# Altium project PCB_Project_3.PrjPcb
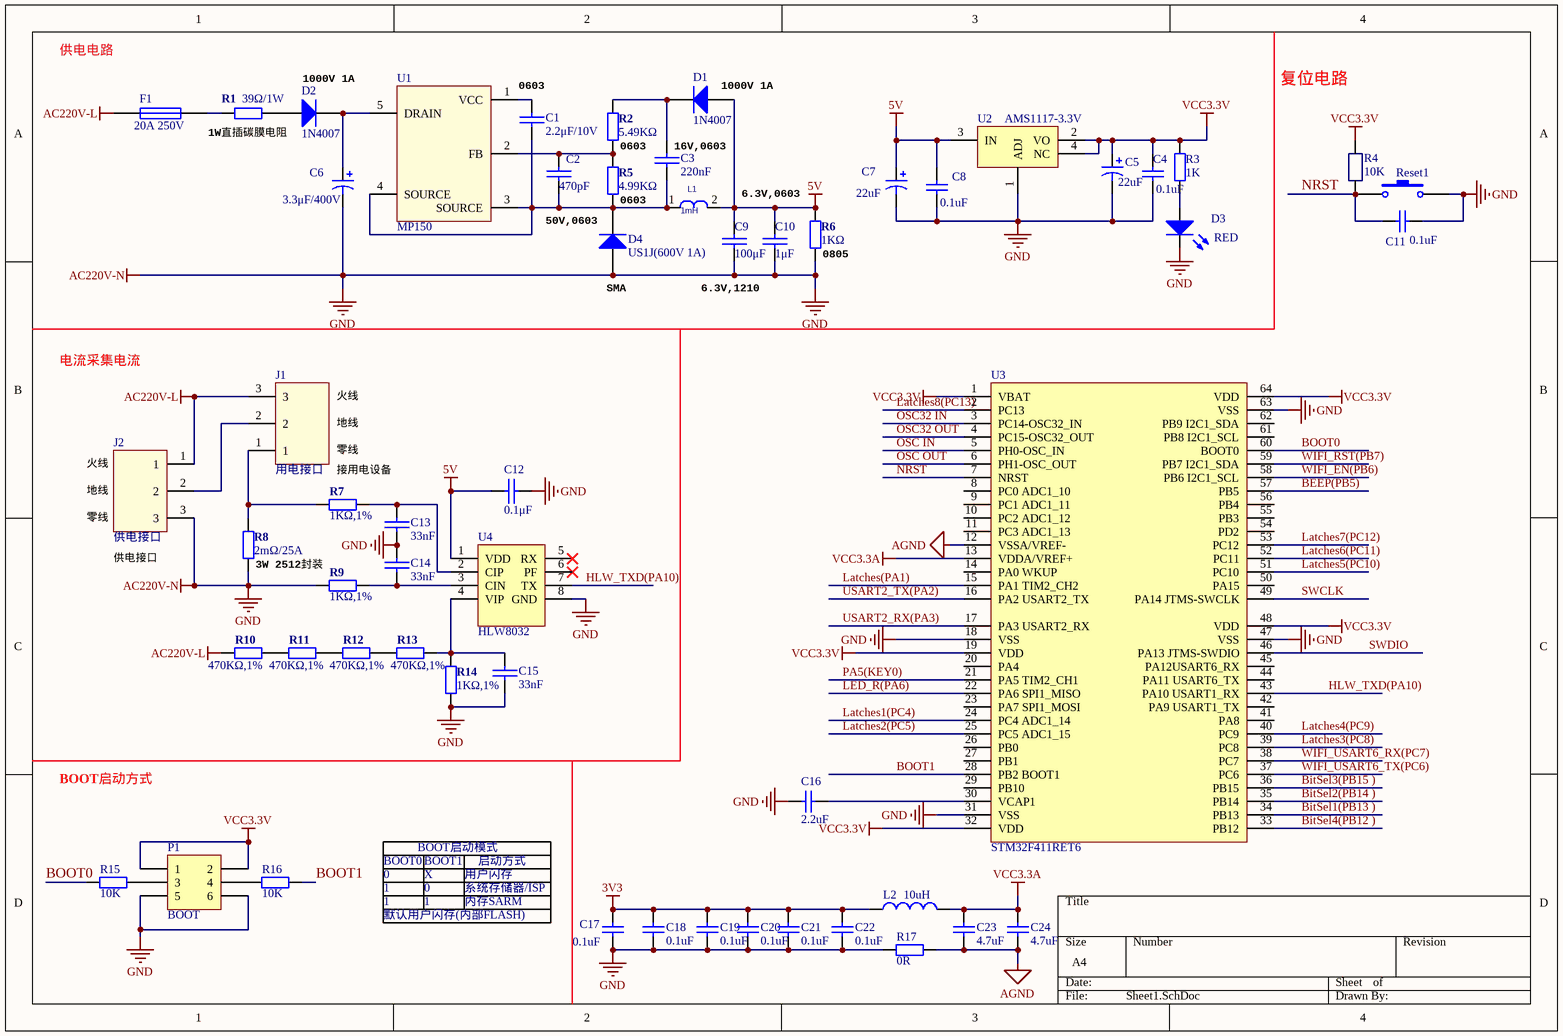
[diagram p0: Sheet1.SchDoc]
2 sheets, 99 parts. Net scope: global (net labels, ports and power ports of the same name join across sheets).
Board file: PCB1.PcbDoc
Sheets:
  Sheet1.SchDoc
  Sheet2.SchDoc

## Sheet Sheet1.SchDoc
size A4

### Parts
C1  2.2μF/10V  [LC-0603_C(2.2UF/10V)]
C2  470pF  [LC-0603_C(普通电容)]
C3  220nF  [LC-0603_C(普通电容)]
C4  0.1uF  [LC-0603_C(普通电容)]
C5  22uF  [钽电容0603（25v）]
C6  3.3μF/400V  [直插电解电容 - duplicate]
C7  22uF  [钽电容0603（25v）]
C8  0.1uF  [LC-0603_C(普通电容)]
C9  100μF  [LC-1210_C大电容]
C10  1μF  [LC-0603_C(普通电容)]
C11  0.1uF  [LC-0603_C(普通电容)]
C12  0.1μF  [LC-0603_C(普通电容)]
C13  33nF  [LC-0805_C]
C14  33nF  [LC-0805_C]
C15  33nF  [LC-0805_C]
C16  2.2uF  [LC-0603_C(普通电容)]
C17  0.1uF  [LC-0603_C(普通电容)]
C18  0.1uF  [LC-0603_C(普通电容)]
C19  0.1uF  [LC-0603_C(普通电容)]
C20  0.1uF  [LC-0603_C(普通电容)]
C21  0.1uF  [LC-0603_C(普通电容)]
C22  0.1uF  [LC-0603_C(普通电容)]
C23  4.7uF  [LC-0603_C(普通电容)]
C24  4.7uF  [LC-0603_C(普通电容)]
D1  1N4007  [1N4007]
D2  1N4007  [1N4007]
D3  RED  [LED0603]
D4  US1J(600V 1A)  [US1J二极管LC-SMA(DO-214AC)_S1]
F1  20A 250V  [FUSE_BASE]
J1  用电接口  [3.81-3P(接线端子)输出]
J2  供电接口  [3.81-3P(接线端子)输入]
L1  1mH  [L-10X14(电感)]
L2  10uH  [电感(L0603)]
P1  BOOT  [Header2*3 2.54mm]
R1  39Ω/1W  [炭膜电阻]
R2  5.49KΩ  [LC-0603_R(电阻)]
R3  value 1K  [LC-0603_R(电阻)]  (hidden comment: 10k)
R4  10K  [LC-0603_R(电阻)]
R5  4.99KΩ  [LC-0603_R(电阻)]
R6  1KΩ  [LC-0805_R]
R7  1KΩ,1%  [LC-0805_R]
R8  2mΩ/25A  [R2512猛铜电阻]
R9  1KΩ,1%  [LC-0805_R]
R10  470KΩ,1%  [LC-0805_R]
R11  470KΩ,1%  [LC-0805_R]
R12  470KΩ,1%  [LC-0805_R]
R13  470KΩ,1%  [LC-0805_R]
R14  1KΩ,1%  [LC-0805_R]
R15  10k  [LC-0603_R(电阻)]
R16  10k  [LC-0603_R(电阻)]
R17  value 0R  [LC-0603_R(电阻)]  (hidden comment: 10k)
Reset1  SW-PB  [key]  (value not drawn)
U1  MP150  [MP150(LC-SOT-23-5)]
U2  AMS1117-3.3V  [SOT-223(ASM117-3.3)]
U3  STM32F411RET6  [MCU-LQFP64]
U4  HLW8032  [(HLW8032)LC-SOP-8_150mil]

### Nets
3V3: C17.2 C18.2 C19.2 C20.1 C21.1 C22.1 L2.1
5V: C7.1 C8.2 C9.2 C10.2 C12.1 D1.1(A) L1.2 R6.2 U2.3(IN) U4.1(VDD)
AC220V-L: F1.2 J1.3 J2.1 R10.2
AC220V-N: C4.1 C5.2 C6.2 C7.2 C8.1 C9.1 C10.1 C11.1 C12.2 C13.2 C14.1 C15.2 C16.1 C17.1 C18.1 C19.1 C20.2 C21.2 C22.2 D3.2(K) D4.1(A) J2.3 P1.5 P1.6 R6.1 R8.2 R9.2 R14.2 R17.2 Reset1.2 U2.1(ADJ) U3.18(VSS) U3.31(VSS) U3.47(VSS) U3.63(VSS) U4.8(GND)  [also labelled GND]
AGND: C23.1 C24.1 R17.1 U3.12(VSSA/VREF-)
VCC3.3A: C23.2 C24.2 L2.2 U3.13(VDDA/VREF+)
VCC3.3V: C4.2 C5.1 P1.1 P1.2 R3.1 R4.2 U2.2(VO) U2.4(NC) U3.1(VBAT) U3.19(VDD) U3.32(VDD) U3.48(VDD) U3.64(VDD)
BEEP(PB5): U3.57(PB5)
BitSel1(PB13 ): U3.34(PB13)
BitSel2(PB14 ): U3.35(PB14)
BitSel3(PB15 ): U3.36(PB15)
BitSel4(PB12 ): U3.33(PB12)
BOOT0: R15.2 U3.60(BOOT0)
BOOT1: R16.1 U3.28(PB2_BOOT1)
HLW_TXD(PA10): U3.43(PA10_USART1_RX) U4.7(TX)
Latches1(PC4): U3.24(PC4_ADC1_14)  [project net JR1]
Latches2(PC5): U3.25(PC5_ADC1_15)  [project net JR2]
Latches3(PC8): U3.39(PC8)  [project net JR3]
Latches4(PC9): U3.40(PC9)  [project net JR4]
Latches5(PC10): U3.51(PC10)  [project net JR5]
Latches6(PC11): U3.52(PC11)  [project net JR6]
Latches7(PC12): U3.53(PC12)  [project net JR7]
Latches8(PC13): U3.2(PC13)  [project net JR8]
Latches(PA1): U3.15(PA1_TIM2_CH2)
LED_R(PA6): U3.22(PA6_SPI1_MISO)
NRST: C11.2 R4.1 Reset1.1 U3.7(NRST)
OSC32 IN: U3.3(PC14-OSC32_IN)
OSC32 OUT: U3.4(PC15-OSC32_OUT)
OSC IN: U3.5(PH0-OSC_IN)
OSC OUT: U3.6(PH1-OSC_OUT)
PA5(KEY0): U3.21(PA5_TIM2_CH1)
SWCLK: U3.49(PA14_JTMS-SWCLK)
SWDIO: U3.46(PA13_JTMS-SWDIO)
USART2_RX(PA3): U3.17(PA3_USART2_RX)
USART2_TX(PA2): U3.16(PA2_USART2_TX)
WIFI_EN(PB6): U3.58(PB6_I2C1_SCL)
WIFI_RST(PB7): U3.59(PB7_I2C1_SDA)
WIFI_USART6_RX(PC7): U3.38(PC7)
WIFI_USART6_TX(PC6): U3.37(PC6)
NetC1_1: C1.1 C2.1 C3.1 D4.2(K) L1.1 R5.1 U1.3(SOURCE) U1.4(SOURCE)
NetC1_2: C1.2 U1.1(VCC)
NetC2_2: C2.2 R2.1 R5.2 U1.2(FB)
NetC3_2: C3.2 D1.2(K) R2.2
NetC6_1: C6.1 D2.2(K) U1.5(DRAIN)
NetC13_1: C13.1 R7.1 U4.2(CIP)
NetC14_2: C14.2 R9.1 U4.3(CIN)
NetC15_1: C15.1 R13.1 R14.1 U4.4(VIP)
NetC16_2: C16.2 U3.30(VCAP1)
NetD2_1: D2.1(A) R1.2
NetD3_1: D3.1(A) R3.2
NetF1_1: F1.1 R1.1
NetJ1_1: J1.1 R7.2 R8.1
NetJ1_2: J1.2 J2.2
NetP1_3: P1.3 R15.1
NetP1_4: P1.4 R16.2
NetR10_1: R10.1 R11.2
NetR11_1: R11.1 R12.2
NetR12_1: R12.1 R13.2

Not connected (* = marked no-connect by the designer): U3 8(PC0_ADC1_10) 9(PC1_ADC1_11) 10(PC2_ADC1_12) 11(PC3_ADC1_13) 14(PA0_WKUP) 20(PA4) 23(PA7_SPI1_MOSI) 26(PB0) 27(PB1) 29(PB10) 41(PA8) 42(PA9_USART1_TX) 44(PA11_USART6_TX) 45(PA12USART6_RX) 50(PA15) 54(PD2) 55(PB3) 56(PB4) 61(PB8_I2C1_SCL) 62(PB9_I2C1_SDA); U4 5(RX)* 6(PF)*

### Notes on the sheet
- 供电电路
- (near D2) 1000V 1A
- 0603
- (near D1) 1000V 1A
- 复位电路
- (near R1) 1W直插碳膜电阻
- (near R2) 0603
- (near C3) 16V,0603
- 50V,0603
- (near R5) 0603
- 6.3V,0603
- (near D4) SMA
- 6.3V,1210
- (near R6) 0805
- 电流采集电流
- 火线
- 地线
- 零线
- (near R7) 接用电设备
- (near J2) 供电接口
- (near R8) 3W 2512封装
- BOOT启动方式
- BOOT启动模式
- BOOT0
- 0
- 1
- 默认用户闪存(内部FLASH)
- BOOT1
- X
- 用户闪存
- 系统存储器/ISP
- 内存SARM
- 启动方式

### Library data of the parts
C1 = CAP: 贴片电容; Value: 100nF (104) ±10% 50V; 封装: 0603; 规格: 2.2uF(2252.2uF(225) ±10% 16V 编带; 立创商城编号: C43922; 名称: 贴片电容
C2 C3 C9 C10 C12-C15 = CAP: 贴片电容; Value: 100nF (104) ±10% 50V
  C2 C3: 立创商城编号: 常用
  C9 C12: 立创商城编号: C49066
  C10: 立创商城编号: C14664
  C13-C15: 立创商城编号: C86036
C4 C17-C22 = CAP: 贴片电容; 封装: 0402; 规格: ±10% 25V; 名称: 贴片电容; 值: 0.1UF
C5 = Cap Pol2: 钽电容; 名称: 钽电容(基美); 封装: CASE-D_7343; 规格: ±10% 25V 编带; 值: 22UF; 立创商城编号: C122303
C6 = Cap Pol1: 直插电解电容; 名称: 电解电容; 规格: 3.3uF 400V 袋装 6.3*12; 立创商城编号: C47905
C7 = Cap Pol2: 钽电容、; 名称: 钽电容(基美); 封装: CASE-D_7343; 规格: ±10% 25V 编带; 值: 22uf; 立创商城编号: C122249
C8 C16 = CAP: 贴片电容; 封装: 0603; 规格: ±10% 25V; 名称: 贴片电容
  C8: 值: 0.1UF
  C16: 值: 2.2UF
C11 = Cap Semi: 贴片电容; Published: 8-Jun-2000; LatestRevisionDate: 29-May-2009; LatestRevisionNote: IPC-7351 Footprint Added.; PackageReference: C1206; Publisher: Altium Limited; PackageDescription: Chip Capacitor; Value: 0.1uF
C23 C24 = CAP: 贴片电容; 封装: 0402; 规格: ±10% 25V; 值: 1UF; 名称: 贴片电容
D1 = Diode 1N5408: 贴片二极管; 名称: 1N4007(SK); 规格: M7 编带; 封装: SMA(DO-214AC)-S1; 立创商城编号: C126233
D2 = Diode 1N5408: 贴片二极管; 名称: 贴片二极管（SK）; 封装: SMA(DO-214AC)-S1; 规格: M7 编带; 立创商城编号: 常用
D3 = LED1: 发光二极管0603; 名称: LED灯; 封装: 0603; 规格: RED
D4 = Diode 1N5408: 贴片二极管; Published: 8-Jun-2000; LatestRevisionDate: 17-Jul-2002; LatestRevisionNote: Re-released for DXP Platform.; DatasheetDocument: Aug-1984; PackageReference: DO-201AD; Publisher: Altium Limited; ComponentLink1Description: Manufacturer Link; ComponentLink1URL: http://www.irf.com/; 立创商城编号: C86560
F1 = Fuse 1: Fuse; 名称: 保险丝夹/座; 规格: 20A，250V，黄铜镀锡(镀镍); 立创商城编号: C3130（座）C13567(保险丝)
J1 J2 = Port-3P: 直插接线端子; 立创商城编号: C36780
L1 = IND_8: 直插绕线电感; CISPartType: Inductor\Ferrite; OriginalSymbolOrigin: (0,0); ATHEROS KEY: 078-100LM-000; AtherosDescription: IND,SMT,SHIELDING CHOKE,10uH,7.3x7.3; 立创商城编号: C72626
L2 = Inductor: 名称: 电感; 值: 4.7UH; 封装: 0603
P1 = Header 3X2: Header, 3-Pin, 杜邦线2.54; LatestRevisionDate: 17-Jul-2002; LatestRevisionNote: Re-released for DXP Platform.; Publisher: Altium Limited
R1 R6 R7 R9 R14 = 电阻: 贴片电阻; 名称: 电阻
  R1: 封装: 39Ω/1W; 立创商城编号: C65614
  R6 R7 R9 R14: 型号: 1KΩ; 立创商城编号: C17513
R2 R5 R8 R10-R13 = 电阻: 贴片电阻; 型号: 1KΩ; 名称: 电阻
  R2: 立创商城编号: C23069
  R5: 立创商城编号: C23046
  R10-R13: 立创商城编号: C17709
R3 R15-R17 = Res2: 贴片电阻; Published: 8-Jun-2000; LatestRevisionDate: 17-Jul-2002; LatestRevisionNote: Re-released for DXP Platform.; PackageReference: AXIAL-0.4; Publisher: Altium Limited; PackageDescription: Axial Device, Thru-Hole; 2 Leads; 0.4 in Pin Spacing
  R15 R16: Value: 10K
R4 = RES: 贴片电阻
Reset1 = SW-PB: 轻触开关 3*6*2.5mm 白头; Published: 24-Mar-1999; LatestRevisionDate: 17-Jul-2002; LatestRevisionNote: Re-released for DXP Platform.; PackageReference: SPST-2; Publisher: Altium Limited; PackageDescription: Switch; 2 Leads
U1 = MP150: IC; 封装: SOT-23-5; 规格: MP150GJ-Z 编带; 名称: MP150; 立创商城编号: C55199
U2 = AMS1117-3.3V: 稳压芯片转3V3; 名称: 低压差线性稳压(LDO); 规格: AMS1117-3.3 编带; 封装: SOT-223; 立创商城编号: C6186
U3 = STM32F411: MCU; 封装: STM-LQFP64_M; 名称: STM32F411RET6
U4 = HLW8032: 电量计芯片

## Sheet Sheet2.SchDoc
size A4
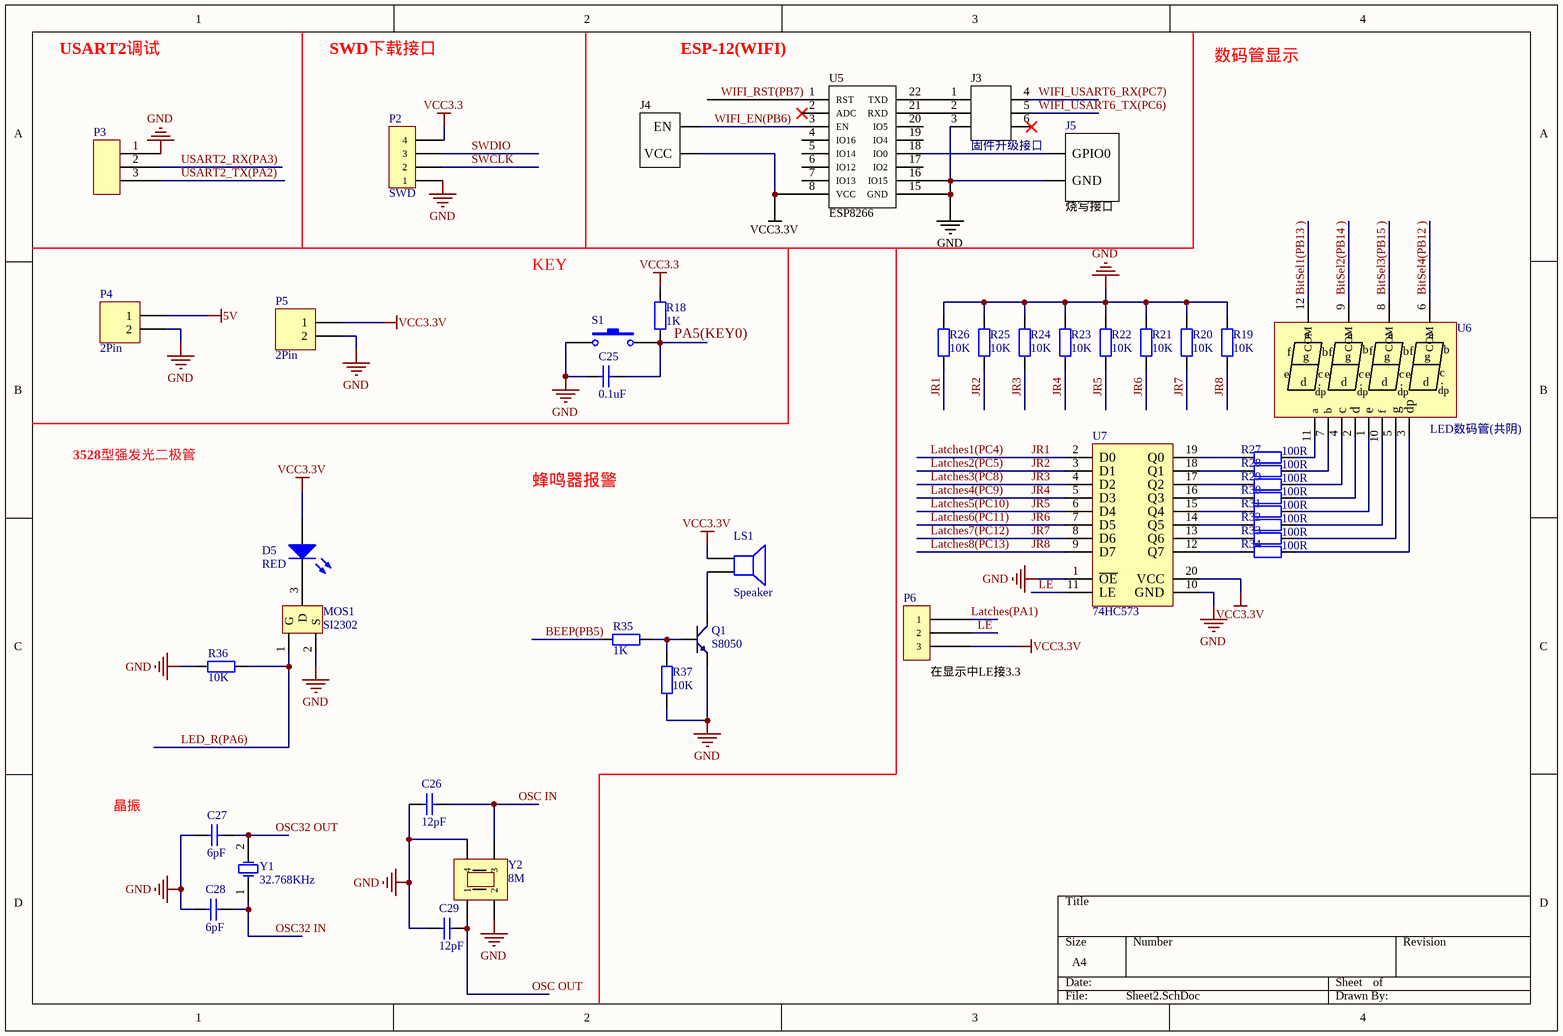
[diagram p1: Sheet2.SchDoc]

### Parts
C25  0.1uF  [LC-0603_C(普通电容)]
C26  值: 12pF  [LC-0603_C(普通电容)]  (hidden comment: 22pF)
C27  6pF  [LC-0603_C(普通电容)]
C28  6pF  [LC-0603_C(普通电容)]
C29  值: 12pF  [LC-0603_C(普通电容)]  (hidden comment: 22pF)
D5  RED  [发光二极管(CASE-B_3528国星光电)]
J3  固件升级接口  [Header2*3 2.54mm]
J4  烧录接口  [Header1*2 2.54mm]  (value not drawn)
J5  烧写接口  [Header1*2 2.54mm]
LS1  Speaker  [BEEP]
MOS1  SI2302  [MOS(SOP-23美微科)]
P2  SWD  [Header1*4 2.54MM]
P3  串口2调试  [Header1*3 2.54mm]  (value not drawn)
P4  2Pin  [Header1*2 2.54mm]
P5  2Pin  [Header1*2 2.54mm]
P6  3P供电选择  [Header1*3 2.54mm]  (value not drawn)
Q1  S8050  [SOP-23(NPN江苏长电)]
R18  1K  [LC-0603_R(电阻)]
R19  10k  [LC-0603_R(电阻)]
R20  10k  [LC-0603_R(电阻)]
R21  10k  [LC-0603_R(电阻)]
R22  10k  [LC-0603_R(电阻)]
R23  10k  [LC-0603_R(电阻)]
R24  10k  [LC-0603_R(电阻)]
R25  10k  [LC-0603_R(电阻)]
R26  10k  [LC-0603_R(电阻)]
R27  value 100R  [LC-0603_R(电阻)]  (hidden comment: 10k)
R28  value 100R  [LC-0603_R(电阻)]  (hidden comment: 10k)
R29  value 100R  [LC-0603_R(电阻)]  (hidden comment: 10k)
R30  value 100R  [LC-0603_R(电阻)]  (hidden comment: 10k)
R31  value 100R  [LC-0603_R(电阻)]  (hidden comment: 10k)
R32  value 100R  [LC-0603_R(电阻)]  (hidden comment: 10k)
R33  value 100R  [LC-0603_R(电阻)]  (hidden comment: 10k)
R34  value 100R  [LC-0603_R(电阻)]  (hidden comment: 10k)
R35  value 1K  [LC-0603_R(电阻)]  (hidden comment: 10k)
R36  10k  [LC-0603_R(电阻)]
R37  10k  [LC-0603_R(电阻)]
S1  SW-PB  [key-4p]  (value not drawn)
U5  ESP8266  [ESP8266]
U6  LED数码管(共阴)  [4位共阴数码管(0.36mm 30*14)]
U7  74HC573  [SOIC-20_300mil(74HC573)]
Y1  32.768KHz  [NX3215晶振]
Y2  8M  [SMD3225(8M晶振)]

### Nets
5V: P4.1
GND: C25.2 C26.2 C27.2 C28.2 C29.2 J3.3(GND) J5.2(GND) MOS1.2(S) P2.1 P3.1(GND) P4.2 P5.2 Q1.2(E) R19.1 R20.1 R21.1 R22.1 R23.1 R24.1 R25.1 R26.1 R36.2 R37.2 S1.1 U5.15(GND) U5.16(IO15) U7.1(~{OE}) U7.10(GND) Y2.2 Y2.4  [project net AC220V-N]
VCC3.3: P2.4 R18.2
VCC3.3V: D5.1(A) J4.1(VCC) LS1.1 P5.1 P6.3 U5.8(VCC) U7.20(VCC)
BEEP(PB5): R35.2
BitSel1(PB13 ): U6.12(COM)
BitSel2(PB14 ): U6.9(COM)
BitSel3(PB15 ): U6.8(COM)
BitSel4(PB12 ): U6.6(COM)
JR1: R26.2 U7.2(D0)  [also labelled Latches1(PC4)]
JR2: R25.2 U7.3(D1)  [also labelled Latches2(PC5)]
JR3: R24.2 U7.4(D2)  [also labelled Latches3(PC8)]
JR4: R23.2 U7.5(D3)  [also labelled Latches4(PC9)]
JR5: R22.2 U7.6(D4)  [also labelled Latches5(PC10)]
JR6: R21.2 U7.7(D5)  [also labelled Latches6(PC11)]
JR7: R20.2 U7.8(D6)  [also labelled Latches7(PC12)]
JR8: R19.2 U7.9(D7)  [also labelled Latches8(PC13)]
Latches(PA1): P6.1
LE: P6.2 U7.11(LE)
LED_R(PA6): MOS1.1(G) R36.1
OSC32 IN: C28.1 Y1.1(OSC1)
OSC32 OUT: C27.1 Y1.2(OSC2)
OSC IN: C26.1 Y2.3
OSC OUT: C29.1 Y2.1
PA5(KEY0): C25.1 R18.1 S1.2
SWCLK: P2.2
SWDIO: P2.3
USART2_RX(PA3): P3.2(PA10(USART1_RX))
USART2_TX(PA2): P3.3(PA9(USART1_TX))
WIFI_EN(PB6): J4.2(EN) U5.3(EN)
WIFI_RST(PB7): U5.1(RST)
WIFI_USART6_RX(PC7): J3.4(RXD)
WIFI_USART6_TX(PC6): J3.5(TXD)
NetD5_2: D5.2(K) MOS1.3(D)
NetJ3_1: J3.1(TXD) U5.22(TXD)
NetJ3_2: J3.2(RXD) U5.21(RXD)
NetJ5_1: J5.1(GPIO0) U5.18(IO0)
NetLS1_2: LS1.2 Q1.3(C)
NetQ1_1: Q1.1(B) R35.1 R37.1
NetR27_1: R27.1 U6.11(a)
NetR27_2: R27.2 U7.19(Q0)
NetR28_1: R28.1 U6.7(b)
NetR28_2: R28.2 U7.18(Q1)
NetR29_1: R29.1 U6.4(c)
NetR29_2: R29.2 U7.17(Q2)
NetR30_1: R30.1 U6.2(d)
NetR30_2: R30.2 U7.16(Q3)
NetR31_1: R31.1 U6.1(e)
NetR31_2: R31.2 U7.15(Q4)
NetR32_1: R32.1 U6.10(f)
NetR32_2: R32.2 U7.14(Q5)
NetR33_1: R33.1 U6.5(g)
NetR33_2: R33.2 U7.13(Q6)
NetR34_1: R34.1 U6.3(dp)
NetR34_2: R34.2 U7.12(Q7)

Not connected (* = marked no-connect by the designer): J3 6(GND)*; U5 2(ADC)* 4(IO16) 5(IO14) 6(IO12) 7(IO13) 17(IO2) 19(IO4) 20(IO5)

### Notes on the sheet
- USART2调试
- SWD下载接口
- ESP-12(WIFI)
- 数码管显示
- KEY
- 3528型强发光二极管
- 蜂鸣器报警
- (near P6) 在显示中LE接3.3
- 晶振
- (in symbol 4位8段数码管) .

### Library data of the parts
C25 = Cap Semi: 贴片电容; Published: 8-Jun-2000; LatestRevisionDate: 29-May-2009; LatestRevisionNote: IPC-7351 Footprint Added.; PackageReference: C1206; Publisher: Altium Limited; PackageDescription: Chip Capacitor; Value: 0.1uF
C26 = Cap Semi: 贴片电阻; 名称: 电容; Published: 8-Jun-2000; LatestRevisionDate: 29-May-2009; LatestRevisionNote: IPC-7351 Footprint Added.; PackageReference: C1206; Publisher: Altium Limited; PackageDescription: Chip Capacitor
C27 = Cap Semi: 贴片电阻; Published: 8-Jun-2000; LatestRevisionDate: 29-May-2009; LatestRevisionNote: IPC-7351 Footprint Added.; PackageReference: C1206; Publisher: Altium Limited; PackageDescription: Chip Capacitor; Value: 6pF
C28 = Cap Semi: 贴片电阻; 名称: 电阻; Published: 8-Jun-2000; LatestRevisionDate: 29-May-2009; LatestRevisionNote: IPC-7351 Footprint Added.; PackageReference: C1206; Publisher: Altium Limited; PackageDescription: Chip Capacitor; 值: 6pF
C29 = Cap Semi: 贴片电容; 名称: 电容; Published: 8-Jun-2000; LatestRevisionDate: 29-May-2009; LatestRevisionNote: IPC-7351 Footprint Added.; PackageReference: C1206; Publisher: Altium Limited; PackageDescription: Chip Capacitor
D5 = LED2: 发光二极管; 封装: CASE-B_3528; 规格: 红色 贴片LED (280-350mcd) 编带; 名称: 发光二极管; 立创商城编号: C85318
J3 = Header2*3: 固件升级接口2.54mm
J4 = ESP烧录: 烧录接口2.54mm
J5 = Header1*2 2.54mm: 烧写接口2.54mm
LS1 = Speaker: Loudspeaker; 名称: 蜂鸣器; 封装: RB5-9
MOS1 = MOS-N: AP2306; 名称: MOS(场效应管)(美微科); 封装: SOT-23(SOT-23-3); 规格: SI2302-TP 编带; 立创商城编号: C77977
P2 = JMP2: 杜邦线2.54
P3 P6 = SIP: 排针 2.54MM
P4 P5 = Header 2: Header, 2-Pin; 名称: 单排排针; 规格: 2.54mmX0.55mm; 封装: HDR1X2
Q1 = S8050: NPN; 名称: 三极管(S8050)长苏长电; 封装: SOT-23(SOT-23-3); 规格: L档120-200 编带; 立创商城编号: C105433
R18-R37 = Res2: 贴片电阻; Published: 8-Jun-2000; LatestRevisionDate: 17-Jul-2002; LatestRevisionNote: Re-released for DXP Platform.; PackageReference: AXIAL-0.4; Publisher: Altium Limited; PackageDescription: Axial Device, Thru-Hole; 2 Leads; 0.4 in Pin Spacing
  R18: Value: 1K
  R19-R26 R36 R37: Value: 10K
S1 = SW-PB: 轻触开关 3*6*2.5mm 白头; Published: 24-Mar-1999; LatestRevisionDate: 17-Jul-2002; LatestRevisionNote: Re-released for DXP Platform.; PackageReference: SPST-2; Publisher: Altium Limited; PackageDescription: Switch; 2 Leads
U5 = ESP8266: ESP-12F; 立创商城编号: C82891
U6 = 4位8段数码管: 共阴数码管; 名称: LED数码管(国产); 封装: 直插; 规格: 四位0.36英寸红色共阴数码管 袋装; 立创商城编号: C10708
U7 = 74HC573: 锁存器; 名称: 74系列逻辑芯片(安世); 封装: SOIC-20_300mil; 规格: 74HC573D,653 编带; 立创商城编号: C5608
Y1 = XTAL: FC135 32.768K 12.5PF 20ppm; 名称: 贴片无源晶振(NDK); 封装: SMD-3215_2P; 规格: 32.768KHZ 6pF 编带; 立创商城编号: C156244
Y2 = XTAL: 25M 20PF 10PPM; 名称: 贴片无源晶振(KDS); 封装: SMD-3225_4P; 规格: 8MHz 12pF 20ppm 编带; 立创商城编号: C57131

## Nets that join several sheets
5V: Sheet1 (10 pins), Sheet2 (P4.1)
AC220V-N: Sheet1 (36 pins), Sheet2 (30 pins)
VCC3.3V: Sheet1 (13 pins), Sheet2 (7 pins)
BEEP(PB5): Sheet1 (U3.57), Sheet2 (R35.2)
BitSel1(PB13 ): Sheet1 (U3.34), Sheet2 (U6.12)
BitSel2(PB14 ): Sheet1 (U3.35), Sheet2 (U6.9)
BitSel3(PB15 ): Sheet1 (U3.36), Sheet2 (U6.8)
BitSel4(PB12 ): Sheet1 (U3.33), Sheet2 (U6.6)
JR1: Sheet1 (U3.24), Sheet2 (R26.2 U7.2)
JR2: Sheet1 (U3.25), Sheet2 (R25.2 U7.3)
JR3: Sheet1 (U3.39), Sheet2 (R24.2 U7.4)
JR4: Sheet1 (U3.40), Sheet2 (R23.2 U7.5)
JR5: Sheet1 (U3.51), Sheet2 (R22.2 U7.6)
JR6: Sheet1 (U3.52), Sheet2 (R21.2 U7.7)
JR7: Sheet1 (U3.53), Sheet2 (R20.2 U7.8)
JR8: Sheet1 (U3.2), Sheet2 (R19.2 U7.9)
Latches(PA1): Sheet1 (U3.15), Sheet2 (P6.1)
LED_R(PA6): Sheet1 (U3.22), Sheet2 (MOS1.1 R36.1)
OSC32 IN: Sheet1 (U3.3), Sheet2 (C28.1 Y1.1)
OSC32 OUT: Sheet1 (U3.4), Sheet2 (C27.1 Y1.2)
OSC IN: Sheet1 (U3.5), Sheet2 (C26.1 Y2.3)
OSC OUT: Sheet1 (U3.6), Sheet2 (C29.1 Y2.1)
PA5(KEY0): Sheet1 (U3.21), Sheet2 (C25.1 R18.1 S1.2)
SWCLK: Sheet1 (U3.49), Sheet2 (P2.2)
SWDIO: Sheet1 (U3.46), Sheet2 (P2.3)
USART2_RX(PA3): Sheet1 (U3.17), Sheet2 (P3.2)
USART2_TX(PA2): Sheet1 (U3.16), Sheet2 (P3.3)
WIFI_EN(PB6): Sheet1 (U3.58), Sheet2 (J4.2 U5.3)
WIFI_RST(PB7): Sheet1 (U3.59), Sheet2 (U5.1)
WIFI_USART6_RX(PC7): Sheet1 (U3.38), Sheet2 (J3.4)
WIFI_USART6_TX(PC6): Sheet1 (U3.37), Sheet2 (J3.5)